# Altium schematic sheet Gyroscope.SchDoc: Gyroscope
size 203 x 127 mm; DrawnBy: Kace Chandler; DocumentNumber: 3; SheetNumber: 3; SheetTotal: 23
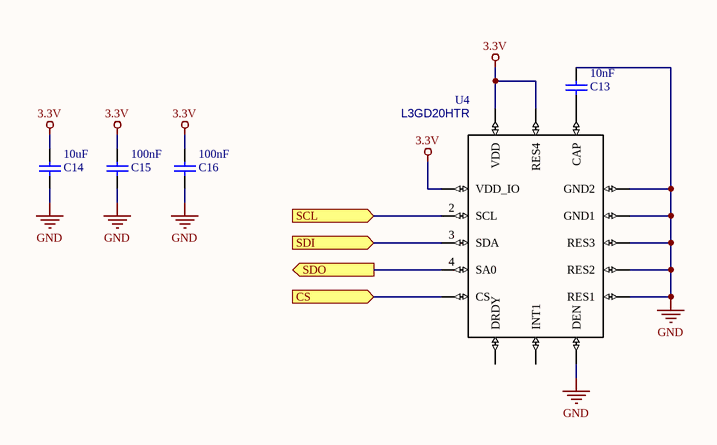
[diagram p0: Gyroscope.SchDoc]

## Parts
C13  value 10nF  [0805 Footprint]  (hidden comment: Cap)
C14  value 10uF  [0805 Footprint]  (hidden comment: Cap)
C15  value 100nF  [0603 to 0805 SMD]  (hidden comment: Cap)
C16  value 100nF  [0603 to 0805 SMD]  (hidden comment: Cap)
U4  L3GD20H  [L3GD20HTR]  (value not drawn)

## Ports
CS (in), SCL (in), SDI (in), SDO (out)

## Nets
3.3V: C14.2 C15.2 C16.2 U4.1(VDD_IO) U4.15(RES4) U4.16(VDD)
GND: C13.2 C14.1 C15.1 C16.1 U4.8(DEN) U4.9(RES1) U4.10(RES2) U4.11(RES3) U4.12(GND1) U4.13(GND2)
CS: U4.5(CS) ; port CS
SCL: U4.2(SCL) ; port SCL
SDI: U4.3(SDA) ; port SDI
SDO: U4.4(SA0) ; port SDO
NetC13_1: C13.1 U4.14(CAP)

Not connected (* = marked no-connect by the designer): U4 6(DRDY) 7(INT1)

## Library data of the parts
C14 C15 = Cap: Near VDD
C16 = Cap: Near VDD_IO
U4 = L3GD20H: Gyroscope L3GD20H Series 3.6 V 6.1 mA Three-Axis Digital Output Gyroscope - LGA-16; MF: STMicroelectronics; Price: None; MP: L3GD20HTR; Availability: Unavailable; SnapEDA_Link: https://www.snapeda.com/parts/L3GD20HTR/STMicroelectronics/view-part/?ref=snap; Package: LGA-16 STMicroelectronics; Value: *; Supplier 1: Digi-Key; Supplier Part Number 1: 497-13931-1-ND